# Altium schematic sheet Sheet1.SchDoc
size 420 x 297 mm; SheetNumber: 1; SheetTotal: 1
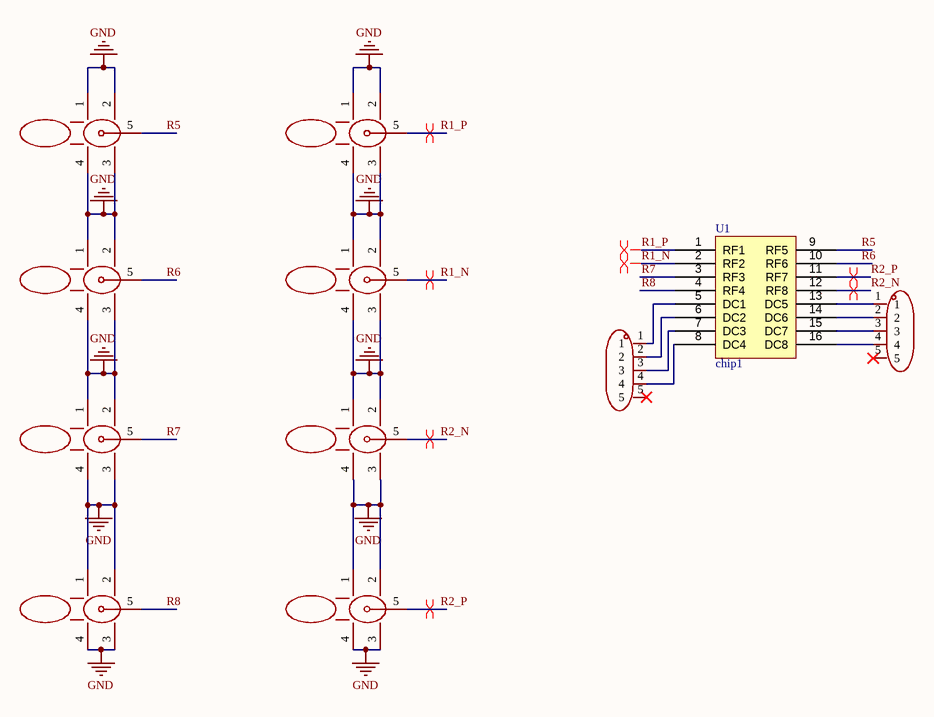
[diagram p0: Sheet1.SchDoc]

## Parts
H1  PZ200V-11-05P  [HDR-TH_5P-P2.00-V-M]  (value not drawn)
H2  PZ200V-11-05P  [HDR-TH_5P-P2.00-V-M]  (value not drawn)
RF1  BWSMA-KE-Z001  [SMA-TH_BWSMA-KE-Z001]  (value not drawn)
RF2  BWSMA-KE-Z001  [SMA-TH_BWSMA-KE-Z001]  (value not drawn)
RF3  BWSMA-KE-Z001  [SMA-TH_BWSMA-KE-Z001]  (value not drawn)
RF4  BWSMA-KE-Z001  [SMA-TH_BWSMA-KE-Z001]  (value not drawn)
RF5  BWSMA-KE-Z001  [SMA-TH_BWSMA-KE-Z001]  (value not drawn)
RF6  BWSMA-KE-Z001  [SMA-TH_BWSMA-KE-Z001]  (value not drawn)
RF7  BWSMA-KE-Z001  [SMA-TH_BWSMA-KE-Z001]  (value not drawn)
RF8  BWSMA-KE-Z001  [SMA-TH_BWSMA-KE-Z001]  (value not drawn)
U1  chip1  [chip1]

## Nets
GND: RF1.1 RF1.2 RF1.3 RF1.4 RF2.1 RF2.2 RF2.3 RF2.4 RF3.1 RF3.2 RF3.3 RF3.4 RF4.1 RF4.2 RF4.3 RF4.4 RF5.1 RF5.2 RF5.3 RF5.4 RF6.1 RF6.2 RF6.3 RF6.4 RF7.1 RF7.2 RF7.3 RF7.4 RF8.1 RF8.2 RF8.3 RF8.4
R1_N: RF4.5 U1.2(RF2)
R1_P: RF2.5 U1.1(RF1)
R2_N: RF6.5 U1.12(RF8)
R2_P: RF8.5 U1.11(RF7)
R5: RF1.5 U1.9(RF5)
R6: RF3.5 U1.10(RF6)
R7: RF5.5 U1.3(RF3)
R8: RF7.5 U1.4(RF4)
NetH1_1: H1.1 U1.13(DC5)
NetH1_2: H1.2 U1.14(DC6)
NetH1_3: H1.3 U1.15(DC7)
NetH1_4: H1.4 U1.16(DC8)
NetH2_1: H2.1 U1.5(DC1)
NetH2_2: H2.2 U1.6(DC2)
NetH2_3: H2.3 U1.7(DC3)
NetH2_4: H2.4 U1.8(DC4)

Not connected (* = marked no-connect by the designer): H1 5*; H2 5*

## Layout directives
differential pair: R1_N, R1_P, R2_N, R2_P

## Notes on the sheet
- THIS DOCUMENT AND THE DATA DISCLOSED HEREIN OR
- HEREWITH IS THE PROPERTY OF ALTIUM LIMITED AND MAY
- DWG NO:
- REVISION
- REV:
- DESCRIPTION
- DATE
- APPROVED
- BE FREELY DISTRIBUTED IN WHOLE. NO RIGHTS ARE
- RESERVED OR EXPRESS OR IMPLIED WARANTEE GIVEN.
- ENG:
- APPROVALS
- PROJECT
- DSN:
- CHK:
- REFERENCE DOCUMENTS
- PROJECT REVISION:
- TITLE
- DOCUMENT REVISION:
- DESIGN ITEM:
- BOM:
- FAB DWG:
- PCB DWG:
- ASSY DWG:
- SCALE:
- A3
- SIZE
- CAGE CODE
- FILE NAME
- DWG NO.
- SHEET
- OF
- REV

## Library data of the parts
H1 H2 = PZ200V-11-05P: Manufacturer: XFCN(兴飞); Add into BOM: yes; Pin Structure: 1x5P; Pitch: 2mm; Circluar Pins/Square Pins: Square Pins; Symbol: PZ200V-11-05P; Device: PZ200V-11-05P; LCSC Part Name: 间距:2mm 1x5P 直插 方针; Supplier Part: C541859; Manufacturer Part: PZ200V-11-05P; Supplier Footprint: 插件,P=2mm; JLCPCB Part Class: Extended Part; Datasheet: https://atta.szlcsc.com/upload/public/pdf/source/20200518/C541858_7610F54454E936EFCDE06B655DF7C837.pdf; Supplier: LCSC; Convert to PCB: yes; Row Spacing: -; Mounting Type: Straight; Number of Rows: Plugin; Number of Pins: 5P; Current Rating (Max): -; Voltage Rating (Max): -; Length of Mating Pin: 3.9mm; Insulation Height: 2mm; Length of End Connection Pin: 2.8mm; Contact Plating: -; Operating Temperature Range: -40℃~+105℃; Soldering Temperature(Max): -; Color: Black
RF1-RF8 = BWSMA-KE-Z001_C496549: Manufacturer: BAT WIRELESS(蝙蝠无线); Add into BOM: yes; Connector Type: 板端; Interface Type: 内孔; Number of Ports: 1; RF Series: SMA; Impedance: 50Ω; Style: 正脚; Symbol: BWSMA-KE-Z001; Device: BWSMA-KE-Z001_C496549; LCSC Part Name: 内孔 SMA 正脚; Supplier Part: C496549; Manufacturer Part: BWSMA-KE-Z001; Supplier Footprint: 插件; JLCPCB Part Class: Extended Part; Datasheet: https://atta.szlcsc.com/upload/public/pdf/source/20221228/40BF41E56A06003A0210E1785CA66EA6.pdf; Supplier: LCSC; Convert to PCB: yes; Interface Diameter: -; Interface Length/Height: -; Frequency-Max: -; Contact Material: -; Contact Plating: -; Operating Temperature Range: -65℃~+165℃; Soldering Temperature(Max): -